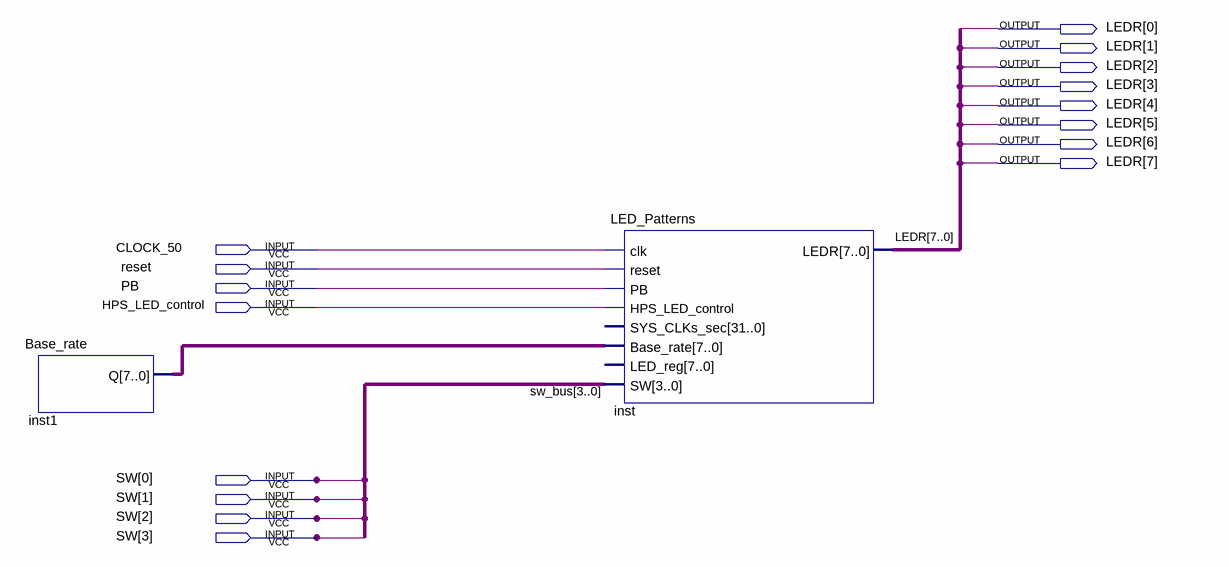
[diagram p0: schematic sheet]
// Quartus schematic TopLevelSchematic.bdf as structural Verilog: 2 symbols, 16 pins
module TopLevelSchematic (
  input  CLOCK_50,
  input  reset,
  input  PB,
  input  HPS_LED_control,
  input  [3:0] SW,
  output [7:0] LEDR
);

  wire [3:0] sw_bus;
  wire [7:0] inst1_q;

  Base_rate inst1 (.Q(inst1_q));
  LED_Patterns inst (
    .clk(CLOCK_50), .reset(reset), .PB(PB), .HPS_LED_control(HPS_LED_control), .Base_rate(inst1_q),
    .SW(sw_bus), .LEDR(LEDR));  // open: SYS_CLKs_sec, LED_reg
endmodule
